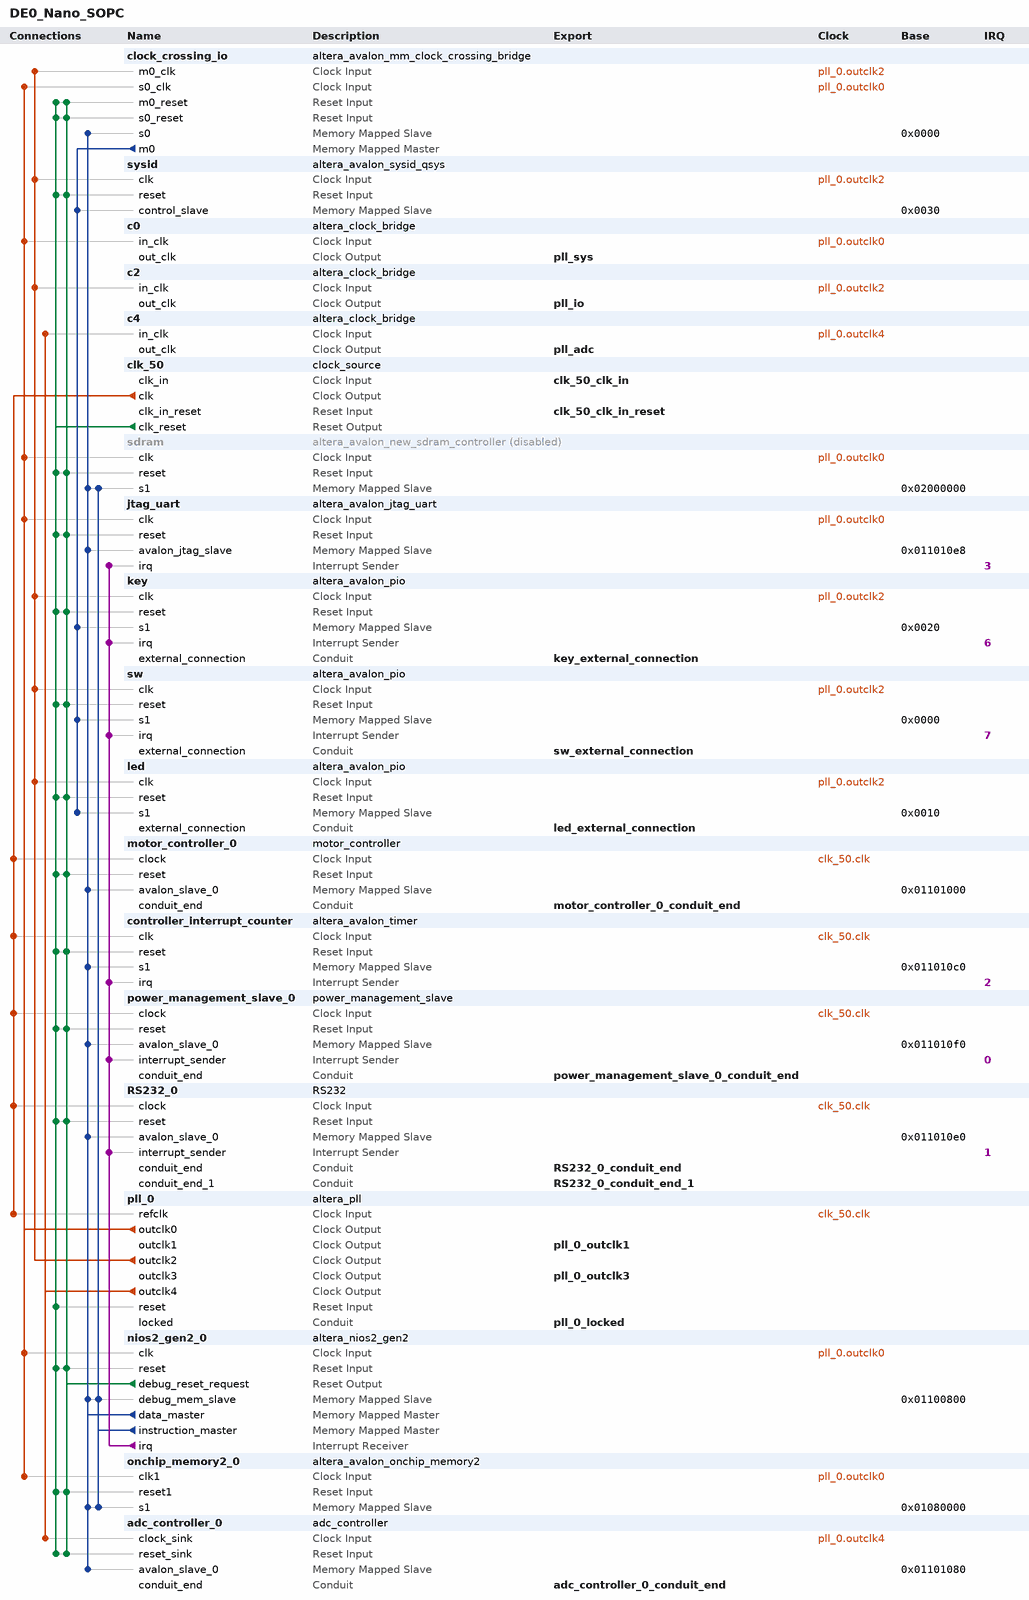
[diagram p0: system contents]
# Platform Designer (Qsys) system DE0_Nano_SOPC, Cyclone V 5CSEMA4U23C6
# Parameters at their usual value, and those the tool derives, are not listed.
package require -exact qsys 15.1
create_system DE0_Nano_SOPC
set_project_property DEVICE_FAMILY {Cyclone V}
set_project_property DEVICE 5CSEMA4U23C6

add_instance clock_crossing_io altera_avalon_mm_clock_crossing_bridge 15.1
set_instance_parameter_value clock_crossing_io ADDRESS_WIDTH 7
set_instance_parameter_value clock_crossing_io COMMAND_FIFO_DEPTH 16
set_instance_parameter_value clock_crossing_io DATA_WIDTH 32
set_instance_parameter_value clock_crossing_io MASTER_SYNC_DEPTH 3
set_instance_parameter_value clock_crossing_io MAX_BURST_SIZE 1
set_instance_parameter_value clock_crossing_io RESPONSE_FIFO_DEPTH 32
set_instance_parameter_value clock_crossing_io SLAVE_SYNC_DEPTH 3
set_instance_parameter_value clock_crossing_io USE_AUTO_ADDRESS_WIDTH 0

add_instance sysid altera_avalon_sysid_qsys 15.1
set_instance_parameter_value sysid id 0

add_instance c0 altera_clock_bridge 15.1
set_instance_parameter_value c0 DERIVED_CLOCK_RATE 100000000
set_instance_parameter_value c0 EXPLICIT_CLOCK_RATE 0

add_instance c2 altera_clock_bridge 15.1
set_instance_parameter_value c2 DERIVED_CLOCK_RATE 10000000
set_instance_parameter_value c2 EXPLICIT_CLOCK_RATE 0

add_instance c4 altera_clock_bridge 15.1
set_instance_parameter_value c4 DERIVED_CLOCK_RATE 2000000
set_instance_parameter_value c4 EXPLICIT_CLOCK_RATE 0

add_instance clk_50 clock_source 15.1
set_instance_parameter_value clk_50 clockFrequency 50000000

add_instance sdram altera_avalon_new_sdram_controller 15.1
set_instance_property sdram ENABLED false
set_instance_parameter_value sdram TAC 5.5
set_instance_parameter_value sdram TRCD 20.0
set_instance_parameter_value sdram TRP 20.0
set_instance_parameter_value sdram casLatency 3
set_instance_parameter_value sdram columnWidth 9
set_instance_parameter_value sdram dataWidth 16
set_instance_parameter_value sdram generateSimulationModel true
set_instance_parameter_value sdram model custom
set_instance_parameter_value sdram numberOfBanks 4
set_instance_parameter_value sdram numberOfChipSelects 1
set_instance_parameter_value sdram powerUpDelay 100.0
set_instance_parameter_value sdram refreshPeriod 15.625
set_instance_parameter_value sdram rowWidth 13

add_instance jtag_uart altera_avalon_jtag_uart 15.1
set_instance_parameter_value jtag_uart simInteractiveOptions INTERACTIVE_ASCII_OUTPUT

add_instance key altera_avalon_pio 15.1
set_instance_parameter_value key captureEdge true
set_instance_parameter_value key direction Input
set_instance_parameter_value key edgeType FALLING
set_instance_parameter_value key generateIRQ true
set_instance_parameter_value key irqType EDGE
set_instance_parameter_value key width 2

add_instance sw altera_avalon_pio 15.1
set_instance_parameter_value sw captureEdge true
set_instance_parameter_value sw direction Input
set_instance_parameter_value sw edgeType ANY
set_instance_parameter_value sw generateIRQ true
set_instance_parameter_value sw irqType EDGE
set_instance_parameter_value sw width 4

add_instance led altera_avalon_pio 15.1
set_instance_parameter_value led direction Output
set_instance_parameter_value led width 8

add_instance motor_controller_0 motor_controller 1.0

add_instance controller_interrupt_counter altera_avalon_timer 15.1
set_instance_parameter_value controller_interrupt_counter period 500000
set_instance_parameter_value controller_interrupt_counter periodUnits CLOCKS

add_instance power_management_slave_0 power_management_slave 1.0

add_instance RS232_0 RS232 1.0
set_instance_parameter_value RS232_0 BAUD_COUNTER_WIDTH 9
set_instance_parameter_value RS232_0 BAUD_TICK_COUNT 433
set_instance_parameter_value RS232_0 BAUD_TICK_INCREMENT 1
set_instance_parameter_value RS232_0 DATA_WIDTH 8
set_instance_parameter_value RS232_0 HALF_BAUD_TICK_COUNT 216
set_instance_parameter_value RS232_0 ODD_PARITY 0
set_instance_parameter_value RS232_0 TOTAL_DATA_WIDTH 11

add_instance pll_0 altera_pll 15.1
set_instance_parameter_value pll_0 gui_device_speed_grade 1
set_instance_parameter_value pll_0 gui_number_of_clocks 5
set_instance_parameter_value pll_0 gui_operation_mode normal
set_instance_parameter_value pll_0 gui_output_clock_frequency0 100.0
set_instance_parameter_value pll_0 gui_output_clock_frequency1 100.0
set_instance_parameter_value pll_0 gui_output_clock_frequency2 10.0
set_instance_parameter_value pll_0 gui_output_clock_frequency3 40.0
set_instance_parameter_value pll_0 gui_phase_shift_deg1 -60.0
set_instance_parameter_value pll_0 gui_pll_auto_reset On
set_instance_parameter_value pll_0 gui_pll_mode {Integer-N PLL}
set_instance_parameter_value pll_0 gui_ps_units0 degrees
set_instance_parameter_value pll_0 gui_ps_units1 degrees
set_instance_parameter_value pll_0 gui_reference_clock_frequency 50.0
set_instance_parameter_value pll_0 gui_use_locked true

add_instance nios2_gen2_0 altera_nios2_gen2 15.1
set_instance_parameter_value nios2_gen2_0 dcache_size 2048
set_instance_parameter_value nios2_gen2_0 exceptionSlave onchip_memory2_0.s1
set_instance_parameter_value nios2_gen2_0 icache_size 4096
set_instance_parameter_value nios2_gen2_0 impl Tiny
set_instance_parameter_value nios2_gen2_0 resetSlave onchip_memory2_0.s1

add_instance onchip_memory2_0 altera_avalon_onchip_memory2 15.1
set_instance_parameter_value onchip_memory2_0 dataWidth 16
set_instance_parameter_value onchip_memory2_0 dualPort false
set_instance_parameter_value onchip_memory2_0 initMemContent true
set_instance_parameter_value onchip_memory2_0 initializationFileName onchip_mem.hex
set_instance_parameter_value onchip_memory2_0 memorySize 266162

add_instance adc_controller_0 adc_controller 1.0

# connections
add_connection clk_50.clk controller_interrupt_counter.clk clock
add_connection clk_50.clk motor_controller_0.clock clock
add_connection clk_50.clk pll_0.refclk clock
add_connection clk_50.clk power_management_slave_0.clock clock
add_connection clk_50.clk RS232_0.clock clock
add_connection pll_0.outclk0 c0.in_clk clock
add_connection pll_0.outclk0 clock_crossing_io.s0_clk clock
add_connection pll_0.outclk0 jtag_uart.clk clock
add_connection pll_0.outclk0 nios2_gen2_0.clk clock
add_connection pll_0.outclk0 onchip_memory2_0.clk1 clock
add_connection pll_0.outclk0 sdram.clk clock
add_connection pll_0.outclk2 c2.in_clk clock
add_connection pll_0.outclk2 clock_crossing_io.m0_clk clock
add_connection pll_0.outclk2 key.clk clock
add_connection pll_0.outclk2 led.clk clock
add_connection pll_0.outclk2 sw.clk clock
add_connection pll_0.outclk2 sysid.clk clock
add_connection pll_0.outclk4 adc_controller_0.clock_sink clock
add_connection pll_0.outclk4 c4.in_clk clock
add_connection clk_50.clk_reset adc_controller_0.reset_sink reset
add_connection clk_50.clk_reset clock_crossing_io.m0_reset reset
add_connection clk_50.clk_reset clock_crossing_io.s0_reset reset
add_connection clk_50.clk_reset controller_interrupt_counter.reset reset
add_connection clk_50.clk_reset jtag_uart.reset reset
add_connection clk_50.clk_reset key.reset reset
add_connection clk_50.clk_reset led.reset reset
add_connection clk_50.clk_reset motor_controller_0.reset reset
add_connection clk_50.clk_reset nios2_gen2_0.reset reset
add_connection clk_50.clk_reset onchip_memory2_0.reset1 reset
add_connection clk_50.clk_reset pll_0.reset reset
add_connection clk_50.clk_reset power_management_slave_0.reset reset
add_connection clk_50.clk_reset RS232_0.reset reset
add_connection clk_50.clk_reset sdram.reset reset
add_connection clk_50.clk_reset sw.reset reset
add_connection clk_50.clk_reset sysid.reset reset
add_connection nios2_gen2_0.debug_reset_request adc_controller_0.reset_sink reset
add_connection nios2_gen2_0.debug_reset_request clock_crossing_io.m0_reset reset
add_connection nios2_gen2_0.debug_reset_request clock_crossing_io.s0_reset reset
add_connection nios2_gen2_0.debug_reset_request controller_interrupt_counter.reset reset
add_connection nios2_gen2_0.debug_reset_request jtag_uart.reset reset
add_connection nios2_gen2_0.debug_reset_request key.reset reset
add_connection nios2_gen2_0.debug_reset_request led.reset reset
add_connection nios2_gen2_0.debug_reset_request motor_controller_0.reset reset
add_connection nios2_gen2_0.debug_reset_request nios2_gen2_0.reset reset
add_connection nios2_gen2_0.debug_reset_request onchip_memory2_0.reset1 reset
add_connection nios2_gen2_0.debug_reset_request power_management_slave_0.reset reset
add_connection nios2_gen2_0.debug_reset_request RS232_0.reset reset
add_connection nios2_gen2_0.debug_reset_request sdram.reset reset
add_connection nios2_gen2_0.debug_reset_request sw.reset reset
add_connection nios2_gen2_0.debug_reset_request sysid.reset reset
add_connection clock_crossing_io.m0 key.s1 avalon
set_connection_parameter_value clock_crossing_io.m0/key.s1 baseAddress 0x0020
add_connection clock_crossing_io.m0 led.s1 avalon
set_connection_parameter_value clock_crossing_io.m0/led.s1 baseAddress 0x0010
add_connection clock_crossing_io.m0 sw.s1 avalon
set_connection_parameter_value clock_crossing_io.m0/sw.s1 baseAddress 0x0000
add_connection clock_crossing_io.m0 sysid.control_slave avalon
set_connection_parameter_value clock_crossing_io.m0/sysid.control_slave baseAddress 0x0030
add_connection nios2_gen2_0.data_master adc_controller_0.avalon_slave_0 avalon
set_connection_parameter_value nios2_gen2_0.data_master/adc_controller_0.avalon_slave_0 baseAddress 0x01101080
add_connection nios2_gen2_0.data_master clock_crossing_io.s0 avalon
set_connection_parameter_value nios2_gen2_0.data_master/clock_crossing_io.s0 baseAddress 0x0000
add_connection nios2_gen2_0.data_master controller_interrupt_counter.s1 avalon
set_connection_parameter_value nios2_gen2_0.data_master/controller_interrupt_counter.s1 baseAddress 0x011010c0
add_connection nios2_gen2_0.data_master jtag_uart.avalon_jtag_slave avalon
set_connection_parameter_value nios2_gen2_0.data_master/jtag_uart.avalon_jtag_slave baseAddress 0x011010e8
add_connection nios2_gen2_0.data_master motor_controller_0.avalon_slave_0 avalon
set_connection_parameter_value nios2_gen2_0.data_master/motor_controller_0.avalon_slave_0 baseAddress 0x01101000
add_connection nios2_gen2_0.data_master nios2_gen2_0.debug_mem_slave avalon
set_connection_parameter_value nios2_gen2_0.data_master/nios2_gen2_0.debug_mem_slave baseAddress 0x01100800
add_connection nios2_gen2_0.data_master onchip_memory2_0.s1 avalon
set_connection_parameter_value nios2_gen2_0.data_master/onchip_memory2_0.s1 baseAddress 0x01080000
add_connection nios2_gen2_0.data_master power_management_slave_0.avalon_slave_0 avalon
set_connection_parameter_value nios2_gen2_0.data_master/power_management_slave_0.avalon_slave_0 baseAddress 0x011010f0
add_connection nios2_gen2_0.data_master RS232_0.avalon_slave_0 avalon
set_connection_parameter_value nios2_gen2_0.data_master/RS232_0.avalon_slave_0 baseAddress 0x011010e0
add_connection nios2_gen2_0.data_master sdram.s1 avalon
set_connection_parameter_value nios2_gen2_0.data_master/sdram.s1 baseAddress 0x02000000
add_connection nios2_gen2_0.instruction_master nios2_gen2_0.debug_mem_slave avalon
set_connection_parameter_value nios2_gen2_0.instruction_master/nios2_gen2_0.debug_mem_slave baseAddress 0x01100800
add_connection nios2_gen2_0.instruction_master onchip_memory2_0.s1 avalon
set_connection_parameter_value nios2_gen2_0.instruction_master/onchip_memory2_0.s1 baseAddress 0x01080000
add_connection nios2_gen2_0.instruction_master sdram.s1 avalon
set_connection_parameter_value nios2_gen2_0.instruction_master/sdram.s1 baseAddress 0x02000000
add_connection nios2_gen2_0.irq controller_interrupt_counter.irq interrupt
set_connection_parameter_value nios2_gen2_0.irq/controller_interrupt_counter.irq irqNumber 2
add_connection nios2_gen2_0.irq jtag_uart.irq interrupt
set_connection_parameter_value nios2_gen2_0.irq/jtag_uart.irq irqNumber 3
add_connection nios2_gen2_0.irq key.irq interrupt
set_connection_parameter_value nios2_gen2_0.irq/key.irq irqNumber 6
add_connection nios2_gen2_0.irq power_management_slave_0.interrupt_sender interrupt
set_connection_parameter_value nios2_gen2_0.irq/power_management_slave_0.interrupt_sender irqNumber 0
add_connection nios2_gen2_0.irq RS232_0.interrupt_sender interrupt
set_connection_parameter_value nios2_gen2_0.irq/RS232_0.interrupt_sender irqNumber 1
add_connection nios2_gen2_0.irq sw.irq interrupt
set_connection_parameter_value nios2_gen2_0.irq/sw.irq irqNumber 7

# exported interfaces
add_interface RS232_0_conduit_end conduit end
set_interface_property RS232_0_conduit_end EXPORT_OF RS232_0.conduit_end
add_interface RS232_0_conduit_end_1 conduit end
set_interface_property RS232_0_conduit_end_1 EXPORT_OF RS232_0.conduit_end_1
add_interface adc_controller_0_conduit_end conduit end
set_interface_property adc_controller_0_conduit_end EXPORT_OF adc_controller_0.conduit_end
add_interface clk_50_clk_in clock sink
set_interface_property clk_50_clk_in EXPORT_OF clk_50.clk_in
add_interface clk_50_clk_in_reset reset sink
set_interface_property clk_50_clk_in_reset EXPORT_OF clk_50.clk_in_reset
add_interface key_external_connection conduit end
set_interface_property key_external_connection EXPORT_OF key.external_connection
add_interface led_external_connection conduit end
set_interface_property led_external_connection EXPORT_OF led.external_connection
add_interface motor_controller_0_conduit_end conduit end
set_interface_property motor_controller_0_conduit_end EXPORT_OF motor_controller_0.conduit_end
add_interface pll_0_locked conduit end
set_interface_property pll_0_locked EXPORT_OF pll_0.locked
add_interface pll_0_outclk1 clock source
set_interface_property pll_0_outclk1 EXPORT_OF pll_0.outclk1
add_interface pll_0_outclk3 clock source
set_interface_property pll_0_outclk3 EXPORT_OF pll_0.outclk3
add_interface pll_adc clock source
set_interface_property pll_adc EXPORT_OF c4.out_clk
add_interface pll_io clock source
set_interface_property pll_io EXPORT_OF c2.out_clk
add_interface pll_sys clock source
set_interface_property pll_sys EXPORT_OF c0.out_clk
add_interface power_management_slave_0_conduit_end conduit end
set_interface_property power_management_slave_0_conduit_end EXPORT_OF power_management_slave_0.conduit_end
add_interface sw_external_connection conduit end
set_interface_property sw_external_connection EXPORT_OF sw.external_connection

set_interconnect_requirement {$system} qsys_mm.clockCrossingAdapter HANDSHAKE
set_interconnect_requirement {$system} qsys_mm.maxAdditionalLatency 0

save_system DE0_Nano_SOPC.qsys
